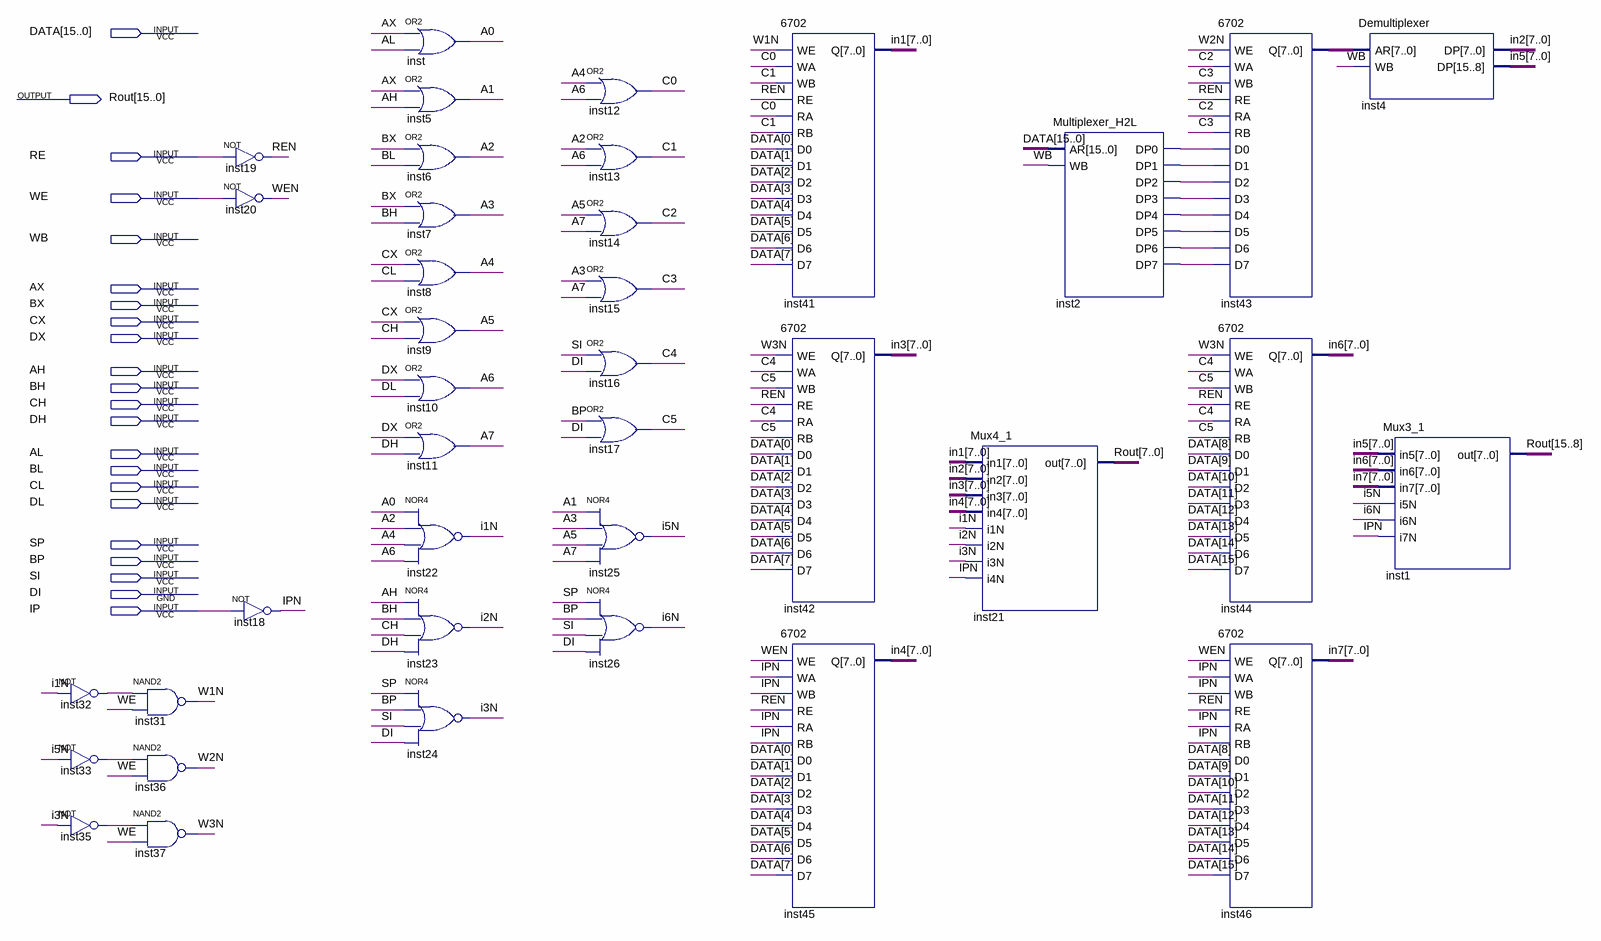
[diagram p0: schematic sheet]
// Quartus schematic registers.bdf as structural Verilog: 38 symbols, 22 pins
module registers (
  input  [15:0] DATA,
  input  RE,
  input  WE,
  input  WB,
  input  AX,
  input  BX,
  input  CX,
  input  DX,
  input  AH,
  input  BH,
  input  CH,
  input  DH,
  input  AL,
  input  BL,
  input  CL,
  input  DL,
  input  SP,
  input  BP,
  input  SI,
  input  DI,
  input  IP,
  output [15:0] Rout
);

  wire A0, A1, A2, A3, A4, A5, A6, A7, C0, C1, C2, C3, C4, C5, i1N, i2N, i3N, i5N, i6N, inst2_dp0, inst2_dp1,
       inst2_dp2, inst2_dp3, inst2_dp4, inst2_dp5, inst2_dp6, inst2_dp7, inst32_out, inst33_out, inst35_out,
       IPN, REN, W1N, W2N, W3N, WEN;
  wire [7:0] in1, in2, in3, in4, in5, in6, in7, inst43_q;

  not inst32 (inst32_out, i1N);
  not inst33 (inst33_out, i5N);
  not inst35 (inst35_out, i3N);
  nand inst31 (W1N, inst32_out, WE);
  nand inst36 (W2N, inst33_out, WE);
  nand inst37 (W3N, inst35_out, WE);
  not inst19 (REN, RE);
  not inst20 (WEN, WE);
  not inst18 (IPN, IP);
  or inst (A0, AX, AL);
  or inst5 (A1, AX, AH);
  or inst6 (A2, BX, BL);
  or inst7 (A3, BX, BH);
  or inst8 (A4, CX, CL);
  or inst9 (A5, CX, CH);
  or inst10 (A6, DX, DL);
  or inst11 (A7, DX, DH);
  nor inst22 (i1N, A0, A2, A4, A6);
  nor inst23 (i2N, AH, BH, CH, DH);
  nor inst24 (i3N, SP, BP, SI, DI);
  or inst12 (C0, A4, A6);
  or inst13 (C1, A2, A6);
  or inst14 (C2, A5, A7);
  or inst15 (C3, A3, A7);
  or inst16 (C4, SI, DI);
  or inst17 (C5, BP, DI);
  nor inst25 (i5N, A1, A3, A5, A7);
  nor inst26 (i6N, SP, BP, SI, DI);
  \6702  inst41 (
    .WE(W1N), .WA(C0), .WB(C1), .RE(REN), .RA(C0), .RB(C1), .D0(DATA[0]), .D1(DATA[1]), .D2(DATA[2]),
    .D3(DATA[3]), .D4(DATA[4]), .D5(DATA[5]), .D6(DATA[6]), .D7(DATA[7]), .Q(in1));
  \6702  inst42 (
    .WE(W3N), .WA(C4), .WB(C5), .RE(REN), .RA(C4), .RB(C5), .D0(DATA[0]), .D1(DATA[1]), .D2(DATA[2]),
    .D3(DATA[3]), .D4(DATA[4]), .D5(DATA[5]), .D6(DATA[6]), .D7(DATA[7]), .Q(in3));
  \6702  inst45 (
    .WE(WEN), .WA(IPN), .WB(IPN), .RE(REN), .RA(IPN), .RB(IPN), .D0(DATA[0]), .D1(DATA[1]), .D2(DATA[2]),
    .D3(DATA[3]), .D4(DATA[4]), .D5(DATA[5]), .D6(DATA[6]), .D7(DATA[7]), .Q(in4));
  Mux4_1 inst21 (
    .in1(in1), .in2(in2), .in3(in3), .in4(in4), .i1N(i1N), .i2N(i2N), .i3N(i3N), .i4N(IPN), .out(Rout[7:0]));
  Multiplexer_H2L inst2 (
    .AR(DATA), .WB(WB), .DP0(inst2_dp0), .DP1(inst2_dp1), .DP2(inst2_dp2), .DP3(inst2_dp3), .DP4(inst2_dp4),
    .DP5(inst2_dp5), .DP6(inst2_dp6), .DP7(inst2_dp7));
  \6702  inst43 (
    .WE(W2N), .WA(C2), .WB(C3), .RE(REN), .RA(C2), .RB(C3), .D0(inst2_dp0), .D1(inst2_dp1), .D2(inst2_dp2),
    .D3(inst2_dp3), .D4(inst2_dp4), .D5(inst2_dp5), .D6(inst2_dp6), .D7(inst2_dp7), .Q(inst43_q));
  \6702  inst44 (
    .WE(W3N), .WA(C4), .WB(C5), .RE(REN), .RA(C4), .RB(C5), .D0(DATA[8]), .D1(DATA[9]), .D2(DATA[10]),
    .D3(DATA[11]), .D4(DATA[12]), .D5(DATA[13]), .D6(DATA[14]), .D7(DATA[15]), .Q(in6));
  \6702  inst46 (
    .WE(WEN), .WA(IPN), .WB(IPN), .RE(REN), .RA(IPN), .RB(IPN), .D0(DATA[8]), .D1(DATA[9]), .D2(DATA[10]),
    .D3(DATA[11]), .D4(DATA[12]), .D5(DATA[13]), .D6(DATA[14]), .D7(DATA[15]), .Q(in7));
  Demultiplexer inst4 (.AR(inst43_q), .WB(WB), .DP({in5, in2}));
  Mux3_1 inst1 (.in5(in5), .in6(in6), .in7(in7), .i5N(i5N), .i6N(i6N), .i7N(IPN), .out(Rout[15:8]));
endmodule
